# Altium schematic sheet I2C_Multiplexers.SchDoc
size A4 portrait
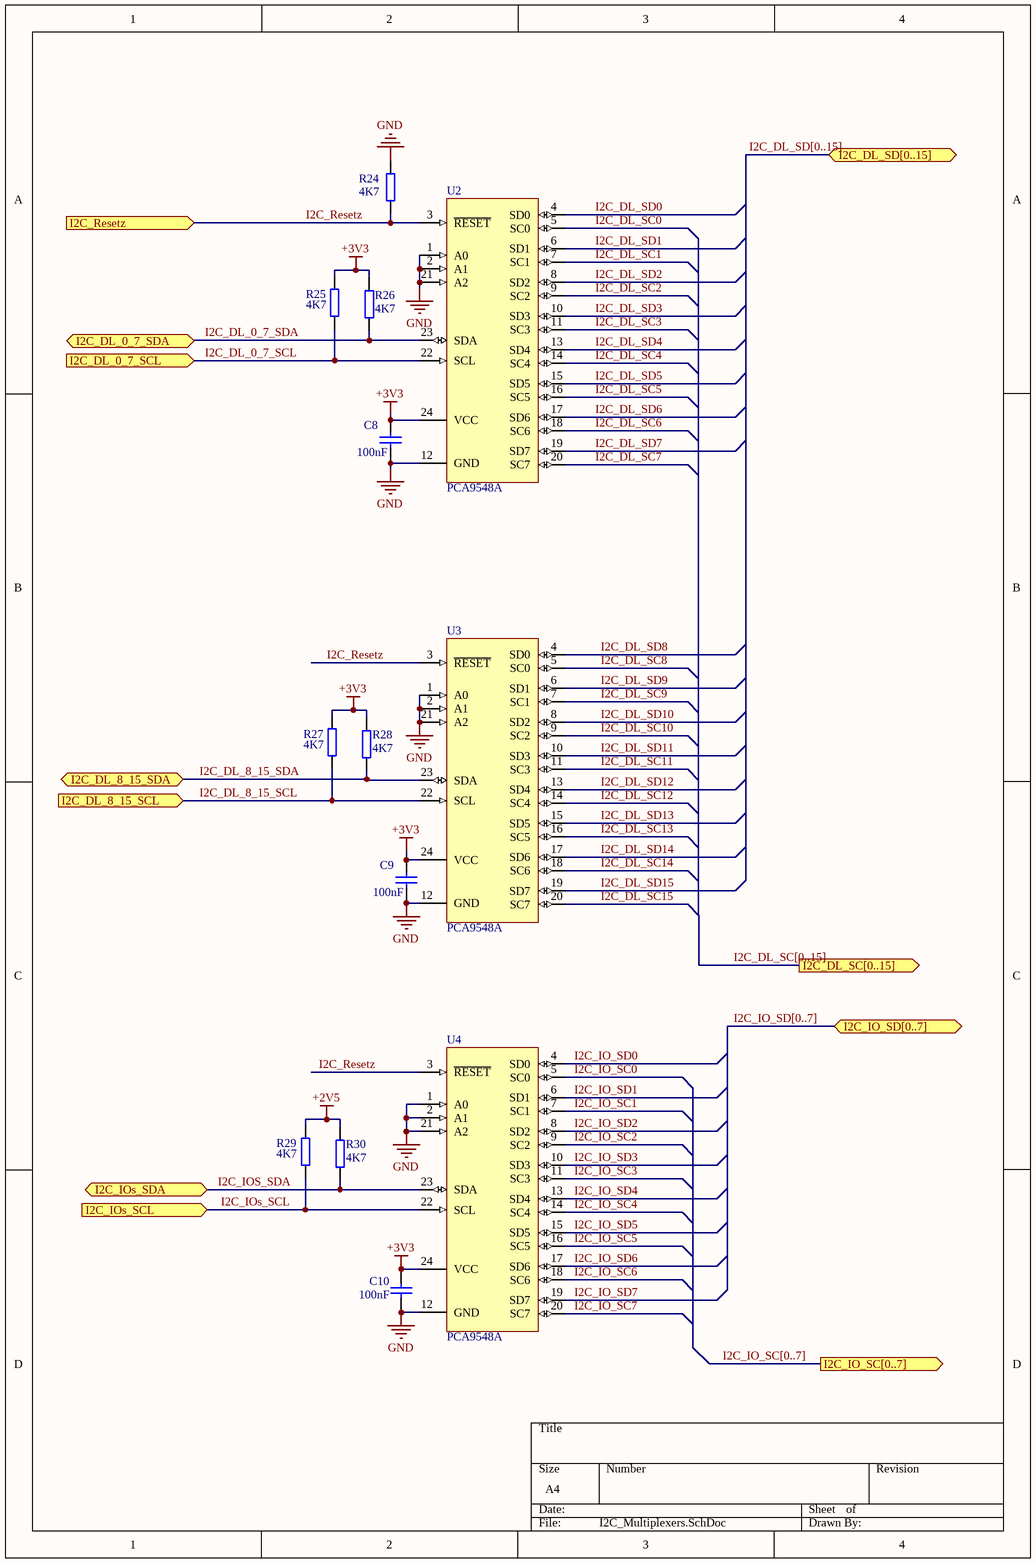
[diagram p0: I2C_Multiplexers.SchDoc]

## Parts
C8  100nF  [CC1608-0603]
C9  100nF  [CC1608-0603]
C10  100nF  [CC1608-0603]
R24  4K7  [0603]
R25  4K7  [0603]
R26  4K7  [0603]
R27  4K7  [0603]
R28  4K7  [0603]
R29  4K7  [0603]
R30  4K7  [0603]
U2  PCA9548A  [SOP65P640X120-24N]
U3  PCA9548A  [SOP65P640X120-24N]
U4  PCA9548A  [SOP65P640X120-24N]

## Ports
I2C_DL_0_7_SCL (in), I2C_DL_0_7_SDA (bidir), I2C_DL_8_15_SCL (in), I2C_DL_8_15_SDA (bidir), I2C_DL_SC[0..15] (out), I2C_DL_SD[0..15] (bidir), I2C_IO_SC[0..7] (out), I2C_IO_SD[0..7] (bidir), I2C_IOs_SCL (in), I2C_IOs_SDA (bidir), I2C_Resetz (in)

## Nets
+2V5: R29.1 R30.1
+3V3: C8.2 C9.2 C10.1 R25.1 R26.1 R27.1 R28.1 U2.24(VCC) U3.24(VCC) U4.24(VCC)
GND: C8.1 C9.1 C10.2 R24.2 U2.1(A0) U2.2(A1) U2.12(GND) U2.21(A2) U3.1(A0) U3.2(A1) U3.12(GND) U3.21(A2) U4.1(A0) U4.2(A1) U4.12(GND) U4.21(A2)
I2C_DL_0_7_SCL: R25.2 U2.22(SCL) ; port I2C_DL_0_7_SCL
I2C_DL_0_7_SDA: R26.2 U2.23(SDA) ; port I2C_DL_0_7_SDA
I2C_DL_8_15_SCL: R27.2 U3.22(SCL) ; port I2C_DL_8_15_SCL
I2C_DL_8_15_SDA: R28.2 U3.23(SDA) ; port I2C_DL_8_15_SDA
I2C_DL_SC0: U2.5(SC0)
I2C_DL_SC1: U2.7(SC1)
I2C_DL_SC2: U2.9(SC2)
I2C_DL_SC3: U2.11(SC3)
I2C_DL_SC4: U2.14(SC4)
I2C_DL_SC5: U2.16(SC5)
I2C_DL_SC6: U2.18(SC6)
I2C_DL_SC7: U2.20(SC7)
I2C_DL_SC8: U3.5(SC0)
I2C_DL_SC9: U3.7(SC1)
I2C_DL_SC10: U3.9(SC2)
I2C_DL_SC11: U3.11(SC3)
I2C_DL_SC12: U3.14(SC4)
I2C_DL_SC13: U3.16(SC5)
I2C_DL_SC14: U3.18(SC6)
I2C_DL_SC15: U3.20(SC7)
I2C_DL_SD0: U2.4(SD0)
I2C_DL_SD1: U2.6(SD1)
I2C_DL_SD2: U2.8(SD2)
I2C_DL_SD3: U2.10(SD3)
I2C_DL_SD4: U2.13(SD4)
I2C_DL_SD5: U2.15(SD5)
I2C_DL_SD6: U2.17(SD6)
I2C_DL_SD7: U2.19(SD7)
I2C_DL_SD8: U3.4(SD0)
I2C_DL_SD9: U3.6(SD1)
I2C_DL_SD10: U3.8(SD2)
I2C_DL_SD11: U3.10(SD3)
I2C_DL_SD12: U3.13(SD4)
I2C_DL_SD13: U3.15(SD5)
I2C_DL_SD14: U3.17(SD6)
I2C_DL_SD15: U3.19(SD7)
I2C_IO_SC0: U4.5(SC0)
I2C_IO_SC1: U4.7(SC1)
I2C_IO_SC2: U4.9(SC2)
I2C_IO_SC3: U4.11(SC3)
I2C_IO_SC4: U4.14(SC4)
I2C_IO_SC5: U4.16(SC5)
I2C_IO_SC6: U4.18(SC6)
I2C_IO_SC7: U4.20(SC7)
I2C_IO_SD0: U4.4(SD0)
I2C_IO_SD1: U4.6(SD1)
I2C_IO_SD2: U4.8(SD2)
I2C_IO_SD3: U4.10(SD3)
I2C_IO_SD4: U4.13(SD4)
I2C_IO_SD5: U4.15(SD5)
I2C_IO_SD6: U4.17(SD6)
I2C_IO_SD7: U4.19(SD7)
I2C_IOs_SCL: R29.2 U4.22(SCL) ; port I2C_IOs_SCL
I2C_IOS_SDA: R30.2 U4.23(SDA) ; port I2C_IOs_SDA
I2C_Resetz: R24.1 U2.3(~{RESET}) U3.3(~{RESET}) U4.3(~{RESET}) ; port I2C_Resetz

## Buses and harness runs
bus I2C_DL_SC[0..15] = port I2C_DL_SC[0..15]
bus I2C_DL_SD[0..15] = port I2C_DL_SD[0..15]
bus I2C_IO_SC[0..7] = port I2C_IO_SC[0..7]
bus I2C_IO_SD[0..7] = port I2C_IO_SD[0..7]

## Library data of the parts
C8-C10 = CC0603_100NF_16V_10%_X7R: Capacitor; Manufacturer1: AVX; Manufacturer1 PN: 0603YC104KAT2A; TC: X7R; Tolerance: ±10%; Voltage: 16V; Published: 8-Jun-2000; LatestRevisionDate: 17-Jul-2002; LatestRevisionNote: Re-released for DXP Platform.; PackageReference: RAD-0.3; Publisher: Altium Limited; Distributor1: Digikey; Distributor1 PN: 478-1239-1-ND; Case: 0603; Value: 100nF
R24-R30 = R0603_4.7K_±1%_0.1W_100PPM: SMD Resistor; Manufacturer1: Panasonic; Manufacturer1 PN: ERJ-3EKF4701V; TCR: 100ppm; Power Rating: 0.1W; Tolerance: ±1%; Case: 0603; Distributor1: DigiKey; Distributor1 PN: P4.70KHCT-ND; Value: 4K7
U2-U4 = PCA9548A: 8-channel 2C-bus switch with reset; Manufacturer1 PN: PCA9548APW,112; Manufacturer1: NXP Semiconductors; Distributor1: Digikey; Distributor1 PN: 568-3384-5-ND